# EAGLE design 2relay (EAGLE 6.6.0)
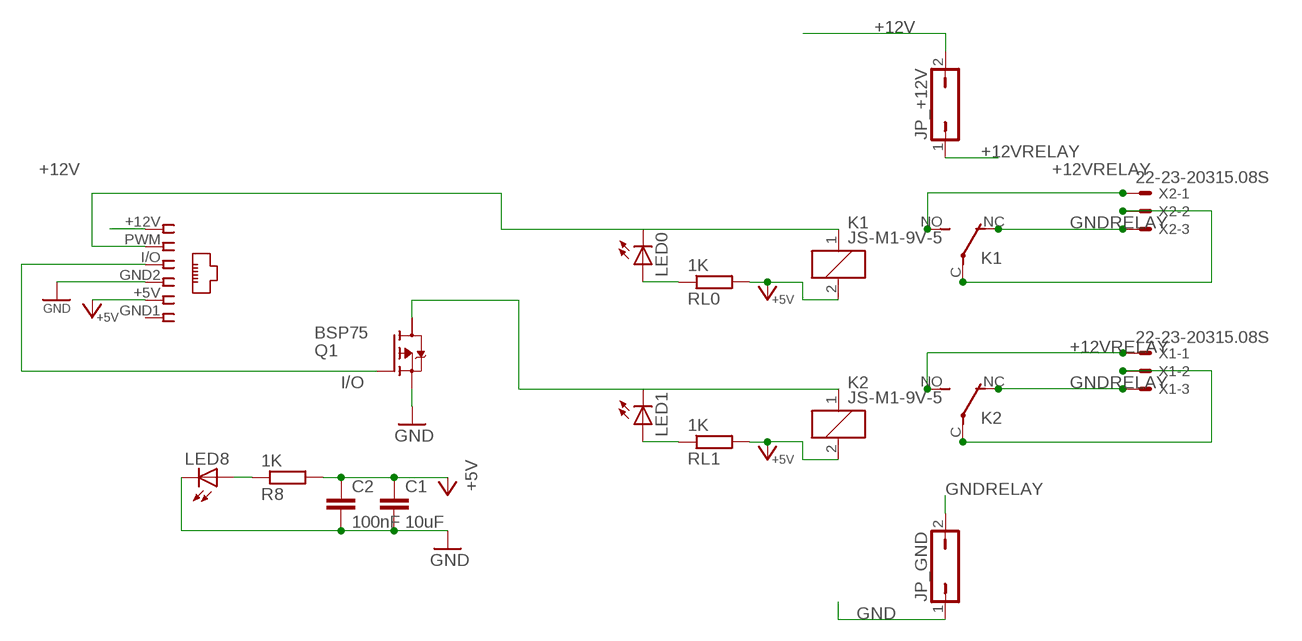
[diagram p0: schematic, sheet 1]

## Parts
C1  10uF  C-EUC1206  [C1206]
C2  100nF  C-EUC1206  [C1206]
I/O_PWM  I2C 1  RJ12STRAIGHT  [RJ12-STRAIGHT]
JP_+12V  JP1Q  [JP1]
JP_GND  JP1Q  [JP1]
K1  JS-M1-9V-5  [JS-M]
K2  JS-M1-9V-5  [JS-M]
LED0  LED1206  [LED-1206]
LED1  LED1206  [LED-1206]
LED8  LED1206  [LED-1206]
Q1  BSP75  BSP613P  [PG-SOT-223]
R8  1K  R-EU_M1206  [M1206]
RL0  1K  R-EU_M1206  [M1206]
RL1  1K  R-EU_M1206  [M1206]
X1  22-23-20315.08S  [3-PIN-5.08S]
X2  22-23-20315.08S  [3-PIN-5.08S]

## Nets
+5V [highpower]: C1.1 C2.1 I/O_PWM.+5V K1.2 K2.2 R8.2 RL0.2 RL1.2
+12V: I/O_PWM.+12V JP_+12V.2
+12VRELAY [highpower]: JP_+12V.1 K1.NO(2:S) K2.NO(2:S) X1.1 X2.1
GND [highpower]: C1.2 C2.2 I/O_PWM.GND2 JP_GND.1 LED8.C Q1.3(S)
GNDRELAY [highpower]: JP_GND.2 K1.NC(2:O) K2.NC(2:O) X1.3 X2.3
I/O: I/O_PWM.I/O Q1.1(G)
N$1 [power]: K2.1 LED1.C Q1.2(D)
N$2: LED0.A RL0.1
N$4: LED1.A RL1.1
N$5 [highpower]: K2.C(2:P) X1.2
N$23: LED8.A R8.1
POWER1 [highpower]: K1.C(2:P) X2.2
PWM: I/O_PWM.PWM K1.1 LED0.C
Unconnected: I/O_PWM.GND1 Q1.4(D)

## Library data of the parts
C1 C2 = rcl:C-EU: CAPACITOR, European symbol
I/O_PWM = lpatiny:RJ12: CORCOM Modular RJ Jacks No Shield Source: www.tycoelectronics.com .. ENG_DS_1654001_1099_RJ_L_0507.pdf
JP_+12V JP_GND = jumper:JP1Q: JUMPER
K1 K2 = relay:JS-M1*: Automotive Ultra-Miniature Power Relay NAiS Source: http://www.mew-europe.com/.. en_ds_61211_0000.pdf; OC_FARNELL: unknown; OC_NEWARK: unknown
LED0 LED1 LED8 = SparkFun:LED: LEDs Standard schematic elements and footprints for 5mm, 3mm, 1206, and 0603 sized LEDs. 5mm - Spark Fun Electronics SKU : COM-00529 (and others)
Q1 = infineon:BSP613P: SIPMOS (R) Small-Signal-Transistor P-Channel (2 Drain) Source: http://www.infineon.com/dgdl/BSP613P_Rev2.4.pdf; OC_FARNELL: unknown; OC_NEWARK: unknown
R8 RL0 RL1 = resistor:R-EU_: RESISTOR, European symbol
X1 X2 = lpatiny:22-23-2031: .100" (2.54mm) Center Header - 3 Pin

## Net classes
0 default: width 0.61 mm
1 power: width 0.914 mm
2 highpower: width 1.372 mm

## Board
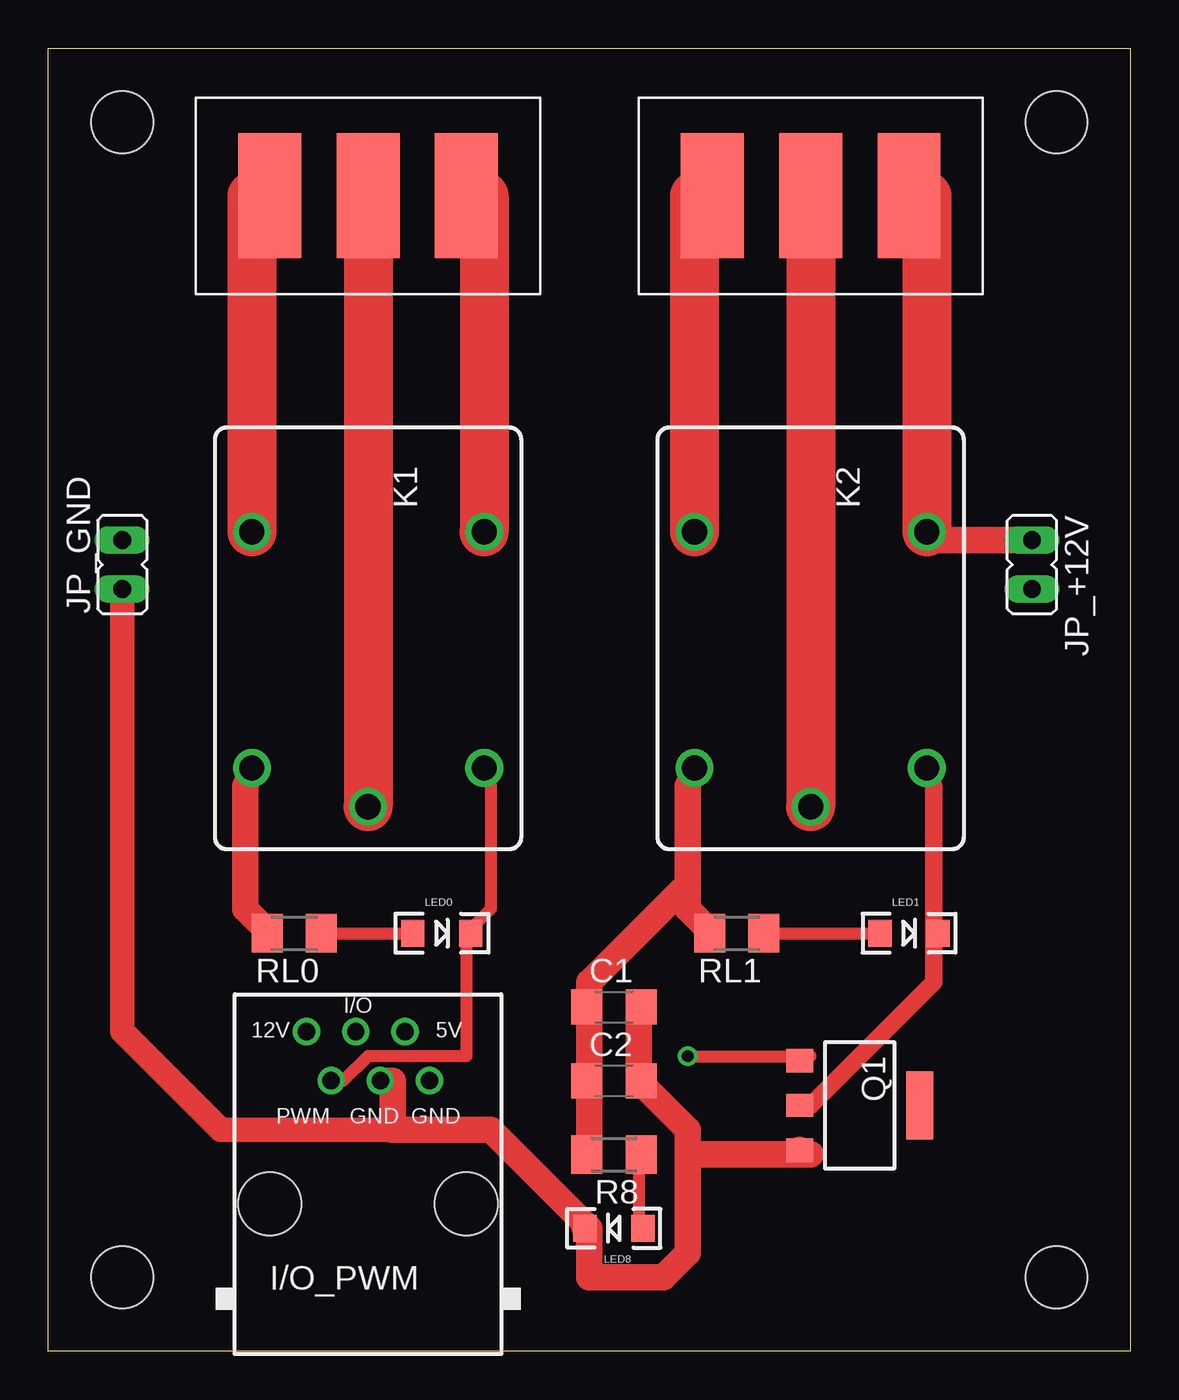
[diagram p1: board, top side]
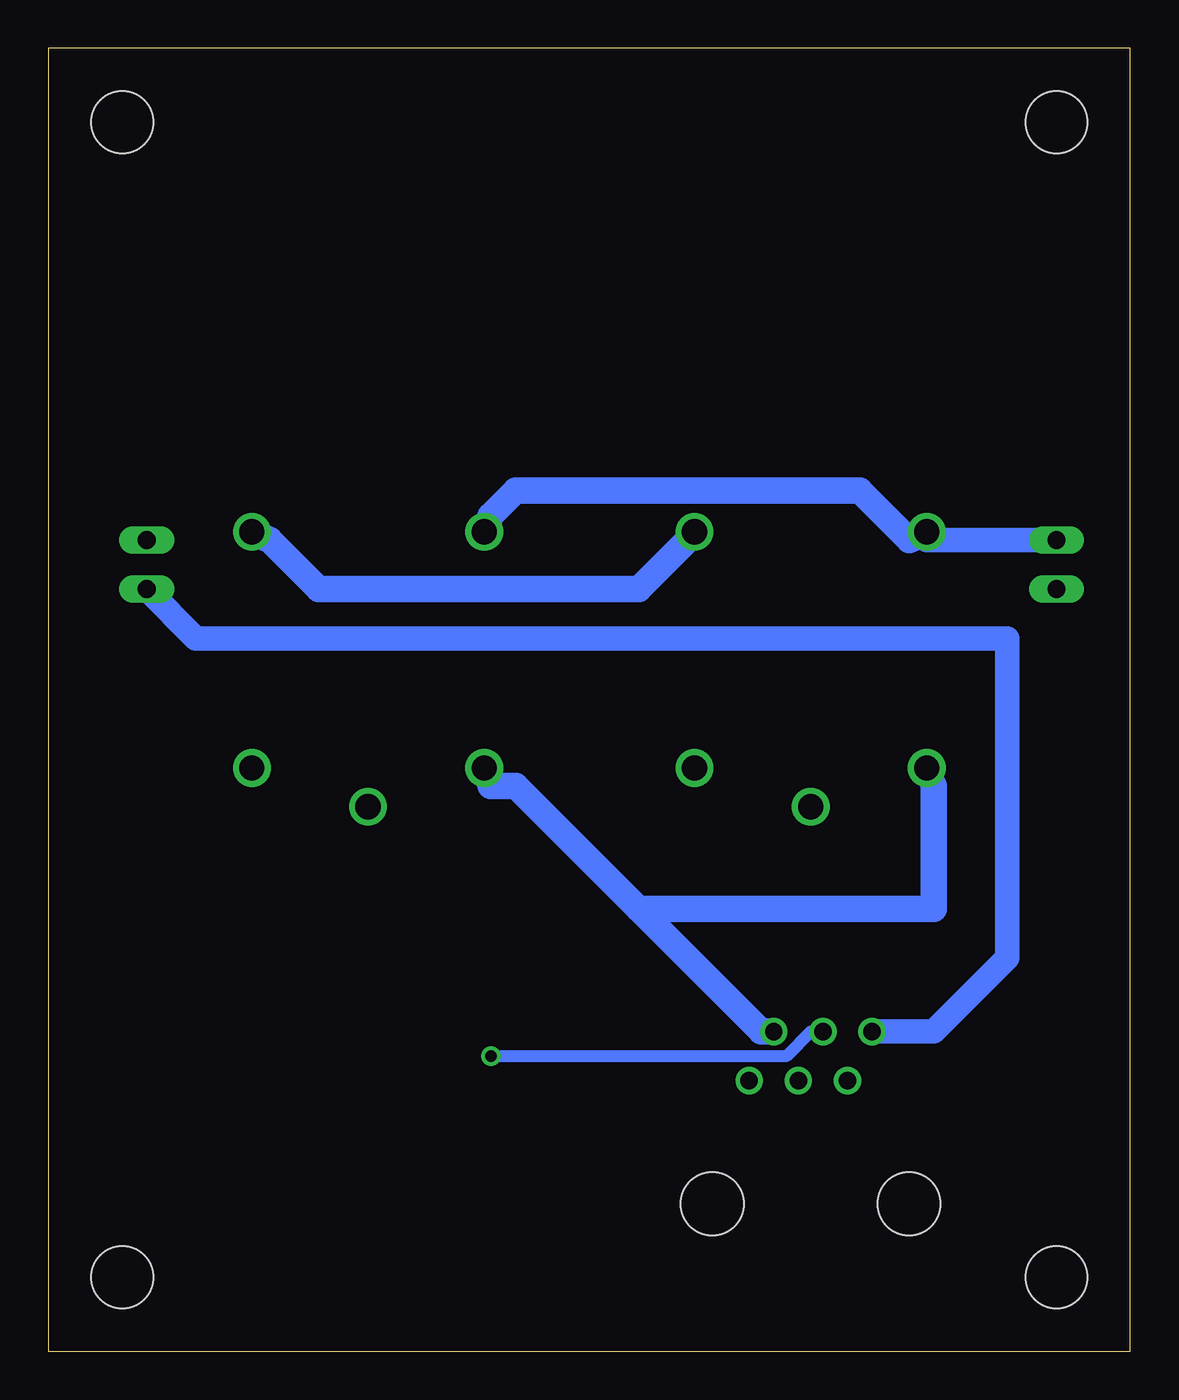
[diagram p2: board, bottom side, seen from below]

Size 55.88 x 67.31 mm. Coordinates in mm from the lower left corner, seen from the top.
Outline: 0,67.31 55.88,67.31 55.88,0 0,0 0,67.31
Copper layers (1*16): Top 0.035mm / dielectric 1.5mm / Bottom 0.035mm
Design rules "default": minimum track width 10mil, minimum drill 24mil, track to track 8mil, track to pad 8mil, pad to pad 8mil, via to via 8mil, smd to smd 8mil, copper to edge 40mil, drill to drill 8mil, minimum pad ring 10mil, minimum via ring 8mil, stop-mask expansion 4mil, vias tented up to drill 0mil, thermal gap 10mil
Holes 3.2 mm at 3.81,63.5 3.81,3.81 52.07,3.81 52.07,63.5
tRestrict: area 35.6,24.1 to 43.2,31.8; area 12.7,24.1 to 20.3,31.8
bRestrict: area 12.7,24.1 to 20.3,31.8; area 35.6,24.1 to 43.2,31.8
Milling: 4 lines

### Footprints (pad centres in the part's own frame; a part is rotated, then mirrored left to right if it is on the bottom)
C1206 = smd 1.6 x 1.8: 1 -1.4,0; 2 1.4,0
RJ12-STRAIGHT = drill 0.9 pad 1.4: +5V 1.905,8.89; +12V -3.175,8.89; GND1 3.175,6.35; GND2 0.635,6.35; I/O -0.635,8.89; PWM -1.905,6.35 | hole 3.251: -5.08,0; 5.08,0
JP1 = drill 0.914 long: 1 0,-1.27; 2 0,1.27
JS-M = drill 1.3: 1 6.7,6; 2 6.7,-6; C 8.7,0; NC -5.5,-6; NO -5.5,6
LED-1206 = smd 1.2 x 1.4: A -1.5,0; C 1.5,0
PG-SOT-223 = smd 1.2 x 1.4: 1 -2.311,-3.099; 2 0,-3.099; 3 2.311,-3.099 | smd 3.5 x 1.4: 4 0,3.099
M1206 = smd 1.6 x 2: 1 -1.4,0; 2 1.4,0
3-PIN-5.08S = smd 3.251 x 6.452: 1 -5.08,0; 2 0,0; 3 5.08,0

### Placement (x,y rotation side)
C1  29.21,17.78 0 top
C2  29.21,13.97 0 top
I/O_PWM  16.51,7.62 0 top
JP_+12V  50.8,40.64 180 top
JP_GND  3.81,40.64 0 top
K1  16.51,36.83 270 top
K2  39.37,36.83 270 top
LED0  20.32,21.59 0 top
LED1  44.45,21.59 0 top
LED8  29.21,6.35 180 top
Q1  41.91,12.7 270 top
R8  29.21,10.16 180 top
RL0  12.7,21.59 180 top
RL1  35.56,21.59 180 top
X1  39.37,59.69 180 top
X2  16.51,59.69 180 top

### Tracks (layer width: path | path; a pad name or v marks a point on that pad's centre or on a via)
+5V
  Top 1.372: RL0.2 11.43,21.59 10.16,22.86 10.16,29.21 K1.2 | 27.94,17.78 27.94,13.97 | 27.94,13.97 27.94,10.16 R8.2 | 27.94,13.97 C2.1 | 33.02,24.13 33.02,29.21 K2.2 | 33.02,24.13 33.02,22.86 34.29,21.59 RL1.2 | 27.94,17.78 27.94,19.05 33.02,24.13 | 27.94,17.78 C1.1
  Bottom 1.372: 25.4,22.86 31.75,29.21 33.02,29.21 K2.2 | 25.4,22.86 19.05,16.51 I/O_PWM.+5V | 25.4,22.86 10.16,22.86 10.16,29.21 K1.2
+12V
  Bottom 1.27: JP_+12V.2 48.26,36.83 6.35,36.83 6.35,20.32 10.16,16.51 I/O_PWM.+12V
+12VRELAY
  Top 1.372: JP_+12V.1 45.72,41.91 45.72,44.45 K2.NO
  Top 2.54: X2.1 22.51,59.69 K1.NO | X1.1 45.37,59.69 K2.NO
  Bottom 1.372: K1.NO 22.86,41.91 25.4,39.37 41.91,39.37 44.45,41.91 K2.NO
GND
  Top 1.27: 17.78,11.43 8.89,11.43 3.81,16.51 JP_GND.1
  Top 1.372: 33.02,10.16 39.37,10.16 Q1.3 | 33.02,10.16 33.02,11.43 30.48,13.97 | 30.48,13.97 30.48,17.78 C1.2 | 30.48,13.97 C2.2 | 27.94,6.35 22.86,11.43 17.78,11.43 17.78,13.97 I/O_PWM.GND2 | 33.02,10.16 33.02,5.08 31.75,3.81 27.94,3.81 27.94,6.35 | 27.94,6.35 LED8.C
GNDRELAY
  Top 0.406: 33.37,59.69 33.02,59.69 33.02,41.91
  Top 2.54: X1.3 33.37,59.69 K2.NC | X2.3 10.51,59.69 K1.NC
  Bottom 0.406: 11.43,41.91 10.51,41.91 K1.NC
  Bottom 1.27: JP_GND.2 10.51,41.91
  Bottom 1.372: K2.NC 33.02,43.18 31.75,44.45 13.97,44.45 11.43,41.91 K1.NC
I/O  (via drill 0.61)
  Top 0.61: v33.02,15.24 39.37,15.24 Q1.1
  Bottom 0.61: v33.02,15.24 17.78,15.24 16.51,16.51 I/O_PWM.I/O
N$1
  Top 0.914: 45.72,21.59 45.72,19.05 39.37,12.7 Q1.2 | 45.72,21.59 45.72,29.21 K2.1 | 45.72,21.59 LED1.C
N$2
  Top 0.61: 19.05,21.59 LED0.A RL0.1 13.97,21.59
N$4
  Top 0.61: 43.18,21.59 LED1.A RL1.1 36.83,21.59
N$5
  Top 2.54: X1.2 K2.C
N$23
  Top 0.61: LED8.A 30.48,6.35 30.48,10.16 R8.1
POWER1
  Top 2.54: X2.2 K1.C
PWM
  Top 0.61: 21.59,21.59 22.86,22.86 22.86,29.21 K1.1 | 21.59,21.59 21.59,15.24 16.51,15.24 15.24,13.97 I/O_PWM.PWM | 21.59,21.59 LED0.C